# EAGLE design Impedance R6 Updated (EAGLE 9.6.2)
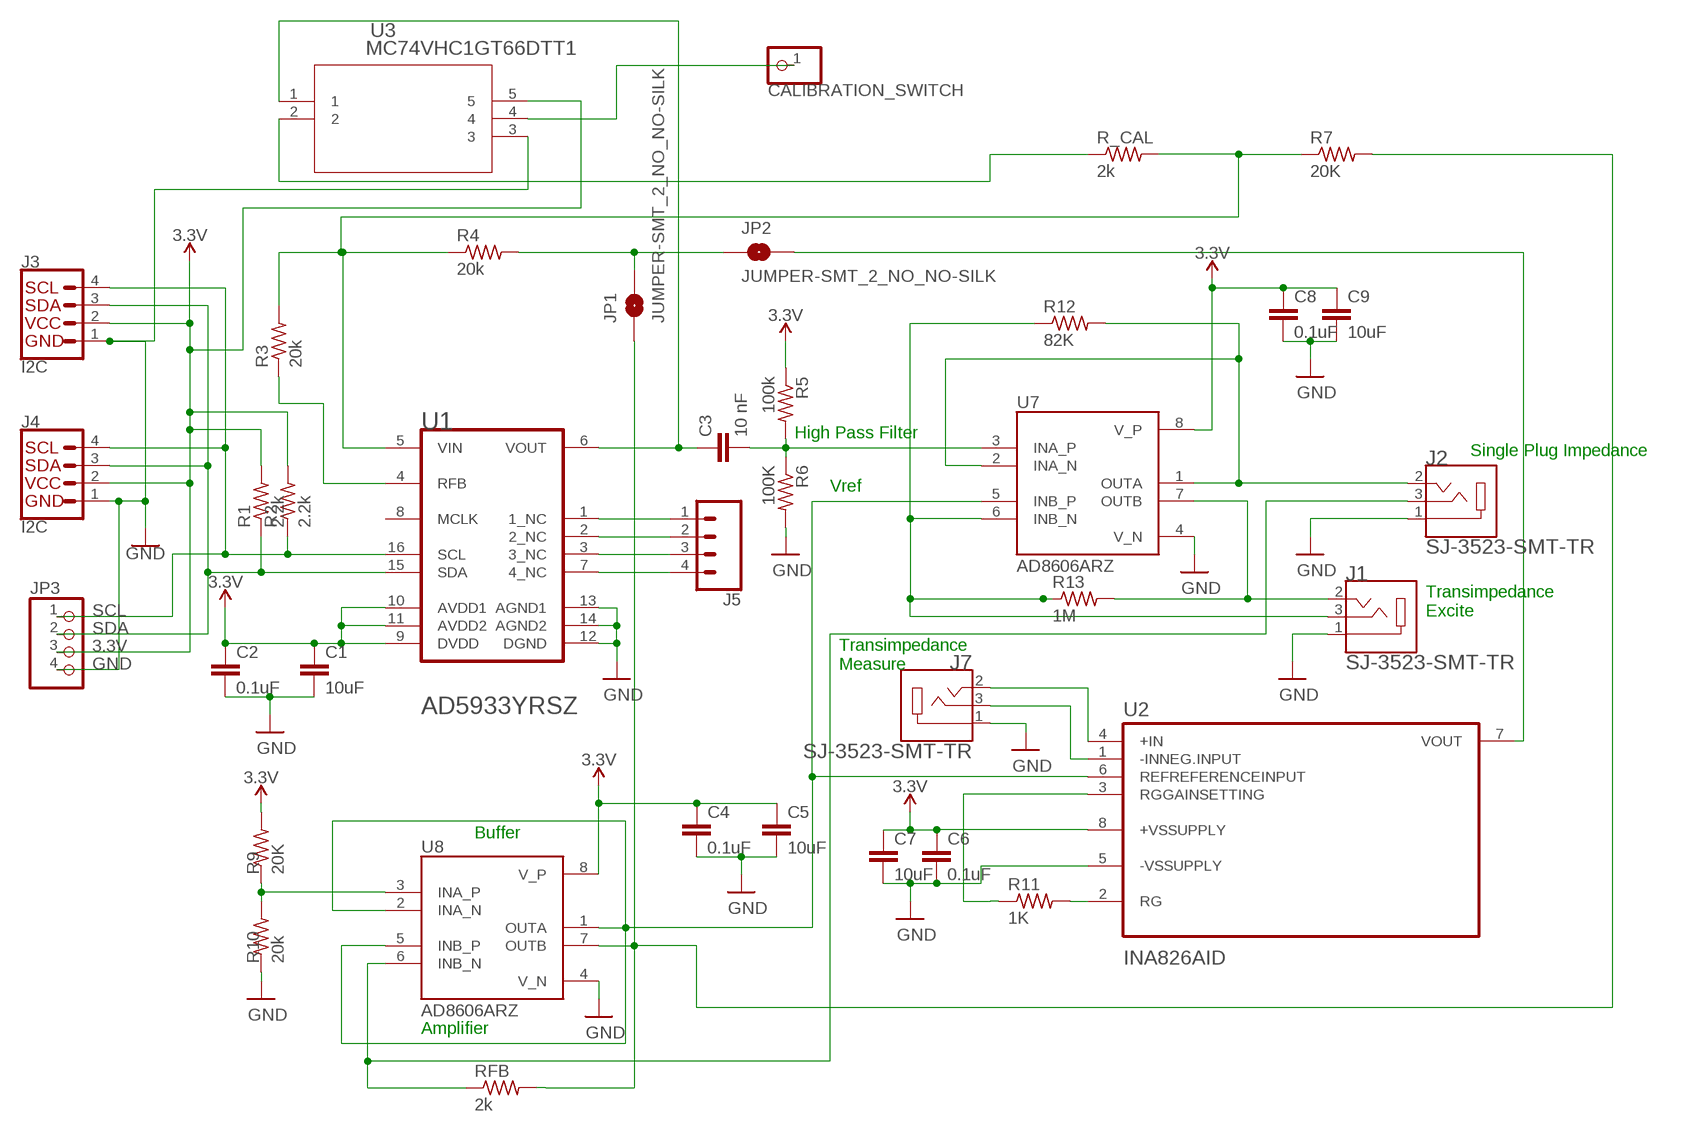
[diagram p0: schematic, sheet 1]

## Parts
C1  10uF  C-EUC0603  [C0603]
C2  0.1uF  C-EUC0603  [C0603]
C3  10 nF  C-EUC0603  [C0603]
C4  0.1uF  C-EUC0603  [C0603]
C5  10uF  C-EUC0603  [C0603]
C6  0.1uF  C-EUC0603  [C0603]
C7  10uF  C-EUC0603  [C0603]
C8  0.1uF  C-EUC0603  [C0603]
C9  10uF  C-EUC0603  [C0603]
CALIBRATION_SWITCH  PINHD-1X1  [1X01]
J1  SJ-3523-SMT-TR  [CUI_SJ-3523-SMT-TR]
J2  SJ-3523-SMT-TR  [CUI_SJ-3523-SMT-TR]
J3  I2C  QWIIC_CONNECTORJS-1MM  [JST04_1MM_RA]
J4  I2C  QWIIC_CONNECTORJS-1MM  [JST04_1MM_RA]
J5  CONN_04  [1X04]
J7  SJ-3523-SMT-TR  [CUI_SJ-3523-SMT-TR]
JP1  JUMPER-SMT_2_NO_NO-SILK  [SMT-JUMPER_2_NO_NO-SILK]
JP2  JUMPER-SMT_2_NO_NO-SILK  [SMT-JUMPER_2_NO_NO-SILK]
JP3  PINHD-1X4  [1X04]
R1  2.2k  R-US_R0603  [R0603]
R2  2.2k  R-US_R0603  [R0603]
R3  20k  R-US_R0603  [R0603]
R4  20k  R-US_R0603  [R0603]
R5  100k  R-US_R0603  [R0603]
R6  100K  R-US_R0603  [R0603]
R7  20K  R-US_R0603  [R0603]
R9  20K  R-US_R0603  [R0603]
R10  20k  R-US_R0603  [R0603]
R11  1K  R-US_R0603  [R0603]
R12  82K  R-US_R0603  [R0603]
R13  1M  R-US_R0603  [R0603]
R_CAL  2k  R-US_R0603  [R0603]
RFB  2k  R-US_R0603  [R0603]
U1  ANALOG_DEVICES_AD5933YRSZANALOG_DEVICES_AD5933YRSZ_0_0  [ANALOG_DEVICES_AD5933YRSZ_0]
U2  INA826AID  [SOIC127P599X175-8N]
U3  MC74VHC1GT66DTT1  [TSOP5_1P65X3P15_ONS]
U7  AD8606ARZ  [SOIC127P600X175-8N]
U8  AD8606ARZ  [SOIC127P600X175-8N]

## Nets
3.3V: C1.1 C2.1 C4.1 C5.1 C6.1 C7.1 C8.1 C9.1 J3.2 J4.2 JP3.3 R1.2 R2.2 R5.1 R9.2 U1.9(DVDD) U1.10(AVDD1) U1.11(AVDD2) U2.8(+VSSUPPLY) U3.5 U7.8(V_P) U8.8(V_P)
GND: C1.2 C2.2 C4.2 C5.2 C6.2 C7.2 C8.2 C9.2 J1.1 J2.1 J3.1 J4.1 J7.1 JP3.4 R6.2 R10.1 U1.12(DGND) U1.13(AGND1) U1.14(AGND2) U2.5(-VSSUPPLY) U3.3 U7.4(V_N) U8.4(V_N)
N$1: C3.1 U1.6(VOUT) U3.1
N$2: R_CAL.1 U3.2
N$3: J5.1 U1.1(1_NC)
N$4: J5.2 U1.2(2_NC)
N$5: R3.1 U1.4(RFB)
N$6: R3.2 R4.1 R7.1 R_CAL.2 U1.5(VIN)
N$7: JP1.2 JP2.1 R4.2
N$9: C3.2 R5.2 R6.1 U7.3(INA_P)
N$10: J5.3 U1.3(3_NC)
N$11: J5.4 U1.7(4_NC)
N$12: JP1.1 R7.2 RFB.2 U8.7(OUTB)
N$13: U2.6(REFREFERENCEINPUT) U7.5(INB_P) U8.1(OUTA) U8.2(INA_N) U8.5(INB_P)
N$14: R9.1 R10.2 U8.3(INA_P)
N$15: J2.2 R12.2 U7.1(OUTA) U7.2(INA_N)
N$16: R11.1 U2.3(RGGAINSETTING)
N$17: J2.3 RFB.1 U8.6(INB_N)
N$18: R11.2 U2.2(RG)
N$19: J1.2 R13.2 U7.7(OUTB)
N$20: J7.2 U2.4(+IN)
N$21: J7.3 U2.1(-INNEG.INPUT)
N$23: J1.3 R12.1 R13.1 U7.6(INB_N)
N$24: CALIBRATION_SWITCH.1 U3.4
N$25: JP2.2 U2.7(VOUT)
SCL: J3.4 J4.4 JP3.1 R2.1 U1.16(SCL)
SDA: J3.3 J4.3 JP3.2 R1.1 U1.15(SDA)
Unconnected: U1.8(MCLK)

## Notes on the sheet
- High Pass Filter
- Single Plug Impedance
- Vref
- Transimpedance
  Excite
- Transimpedance
  Measure
- Buffer
- Amplifier

## Library data of the parts
C1-C9 = rcl:C-EU: CAPACITOR, European symbol; SPICEPREFIX: C
CALIBRATION_SWITCH = pinhead:PINHD-1X1: PIN HEADER
J1 J2 J7 = SJ-3523-SMT-TR:SJ-3523-SMT-TR: Audio Jack Connector 3.5 mm Low Profile Surface Mount Stereo Jack, 3 Pin Right-Angle Check availability <https://pricing.snapeda.com/parts/SJ-3523-SMT-TR/CUI%20Devices/view-part?ref=eda>; AVAILABILITY: In Stock; CUI_PURCHASE_URL: https://www.cuidevices.com/product/interconnect/connectors/audio-connectors/jacks/sj-352x-smt-series?utm_source=snapeda.com&utm_medium=referral&utm_campaign=snapedaBOM; DESCRIPTION: 3.5 mm, Stereo, Right Angle, Surface Mount (SMT), 3 Conductors, 0~1 Internal Switches, Audio Jack Connector; MF: CUI Devices; MP: SJ-3523-SMT-TR; PACKAGE: None; PRICE: None; PURCHASE-URL: https://pricing.snapeda.com/search/part/SJ-3523-SMT-TR/?ref=eda
J3 J4 = SparkFun-Connectors:QWIIC_CONNECTOR: SparkFun I2C Standard Qwiic Connector An SMD 1mm pitch JST connector makes it easy and quick (get it? Qwiic?) to connect I2C devices to each other. The Qwiic system <http://www.sparkfun.com/qwiic> enables fast and solderless connection between popular platforms and various sensors and actuators. We carry 200mm <https://www.sparkfun.com/products/14204>, 100mm <https://www.sparkfun.com/products/14205>, 50mm <https://www.sparkfun.com/products/14206>, and breadboard friendly <https://www.sparkfun.com/products/14207> Qwiic cables. We also offer 10 pcs strips <https://www.sparkfun.com/products/14323> the SMD connectors.; PROD_ID: CONN-13694
J5 = SparkFun-Connectors:CONN_04: Multi connection point. Often used as Generic Header-pin footprint for 0.1 inch spaced/style header connections On any of the 0.1 inch spaced packages, you can populate with these: Break Away Headers - Straight <https://www.sparkfun.com/products/116> (PRT-00116) Break Away Male Headers - Right Angle <https://www.sparkfun.com/products/553> (PRT-00553) Female Headers <https://www.sparkfun.com/products/115> (PRT-00115) Break Away Headers - Machine Pin <https://www.sparkfun.com/products/117> (PRT-00117) Break Away Female Headers - Swiss Machine Pin <https://www.sparkfun.com/products/743> (PRT-00743) For SCREWTERMINALS and SPRING TERMINALS visit here: Screw Terimnals on SparkFun.com <https://www.sparkfun.com/search/results?term=Screw+Terminals> (5mm/3.5mm/2.54mm spacing) This device is also useful as a general connection point to wire up your design to another part of your project. Our various solder wires solder well into these plated through hole pads. Hook-Up Wire - Assortment (Stranded, 22 AWG) <https://www.sparkfun.com/products/11375> (PRT-11375) Hook-Up Wire - Assortment (Solid Core, 22 AWG) <https://www.sparkfun.com/products/11367> (PRT-11367) View the entire wire category on our website here <https://www.sparkfun.com/categories/141> Special notes: Molex polarized connector foot print use with SKU : PRT-08231 with associated crimp pins and housings. 1MM SMD Version SKU: PRT-10208; PROD_ID: CONN-09696
JP1 JP2 = SparkFun-Jumpers:JUMPER-SMT_2_NO: Normally open jumper This jumper has two pads in close proximity to each other. Apply solder to close the connection. Round pads are easier to solder for beginners, but are a lot larger. SparkFun Product that uses the round pads: SparkFun EL Sequencer <https://www.sparkfun.com/products/12781>
JP3 = pinhead:PINHD-1X4: PIN HEADER
R1-R7 R9-R13 R_CAL RFB = rcl:R-US_: RESISTOR, American symbol; SPICEPREFIX: R
U1 = Analog Devices - AD5933YRSZ:ANALOG_DEVICES_AD5933YRSZ: ADI-AD5933-RS-16; CIIVA_IDS: 19299999; CODE__JEDEC: MO-150-AC; COMPONENT_LINK_1_DESCRIPTION: Manufacturer URL; COMPONENT_LINK_1_URL: www.analog.com; COMPONENT_LINK_3_DESCRIPTION: Package Specification; COMPONENT_LINK_3_URL: http://www.analog.com/static/imported-files/packages/31572257652246RS_16.pdf; DATASHEET: http://www.analog.com/static/imported-files/data_sheets/AD5933.pdf; DATASHEET_VERSION: Rev. D; FOOTPRINT_VARIANT_NAME_0: Level C; FOOTPRINT_VARIANT_NAME_1: Level B; FOOTPRINT_VARIANT_NAME_2: Level A; IMPORTED: yes; IMPORTED_FROM: vault; IMPORT_TS: 1521848033; IO_INTERFACE: Serial; I_SUPPLY_TOTAL_MAX: 15mA; MASTER_FCLK: 16.776MHz; MF: Analog Devices; MPN: AD5933YRSZ; PACKAGE: RS-16; PACKAGE_DESCRIPTION: 16-Lead Shrink Small Outline Package [SSOP]; PACKAGE_VERSION: 3/17/2005; PIN_0_0_15_INSIDE_EDGE: clock; PIN_0_0_7_INSIDE_EDGE: clock; PREFIX: U; RELEASE_DATE: 1333437714; RESOLUTION_BITS: 12bit; TUNING_WORD_WIDTH_BITS: 27bit; VAULT_GUID: 12E548FF-7E75-4596-9B3A-06B167E4919E; VAULT_REVISION: 0B288880-7FBC-46A2-8187-17CED40A7223
U2 = INA826AID:INA826AID: Check availability <https://pricing.snapeda.com/parts/INA826AID/Texas%20Instruments/view-part?ref=eda>; AVAILABILITY: In Stock; CHECK_PRICES: https://www.snapeda.com/parts/INA826AID/Texas+Instruments/view-part/?ref=eda; DESCRIPTION: Precision, 200-μA Supply Current, 36-V Supply Instrumentation Amplifier; MF: Texas Instruments; MP: INA826AID; PACKAGE: SOIC-8 Texas Instruments; PRICE: None; PURCHASE-URL: https://www.snapeda.com/api/url_track_click_mouser/?unipart_id=217743&manufacturer=Texas Instruments&part_name=INA826AID&search_term=None; SNAPEDA_LINK: https://www.snapeda.com/parts/INA826AID/Texas+Instruments/view-part/?ref=snap
U3 = MC74VHC1GT66DTT1:MC74VHC1GT66DTT1; COPYRIGHT: Copyright (C) 2024 Ultra Librarian. All rights reserved.; MANUFACTURER_PART_NUMBER: MC74VHC1GT66DTT1; MFR_NAME: onsemi
U7 U8 = AD8606ARZ:AD8606ARZ: Operational amplifier; 10MHz; 2.7÷5VDC; Channels: 2; SO8 Check availability <https://pricing.snapeda.com/parts/AD8606ARZ/Analog%20Devices/view-part?ref=eda>; AVAILABILITY: In Stock; CHECK_PRICES: https://www.snapeda.com/parts/AD8606ARZ/Analog+Devices/view-part/?ref=eda; DESCRIPTION: Precision, Low Noise, RRIO, CMOS Op Amp (Dual); MF: Analog Devices; MP: AD8606ARZ; PACKAGE: SOIC-8 Analog Devices; PRICE: None; PURCHASE-URL: https://www.snapeda.com/api/url_track_click_mouser/?unipart_id=43414&manufacturer=Analog Devices&part_name=AD8606ARZ&search_term=None; SNAPEDA_LINK: https://www.snapeda.com/parts/AD8606ARZ/Analog+Devices/view-part/?ref=snap

## Board
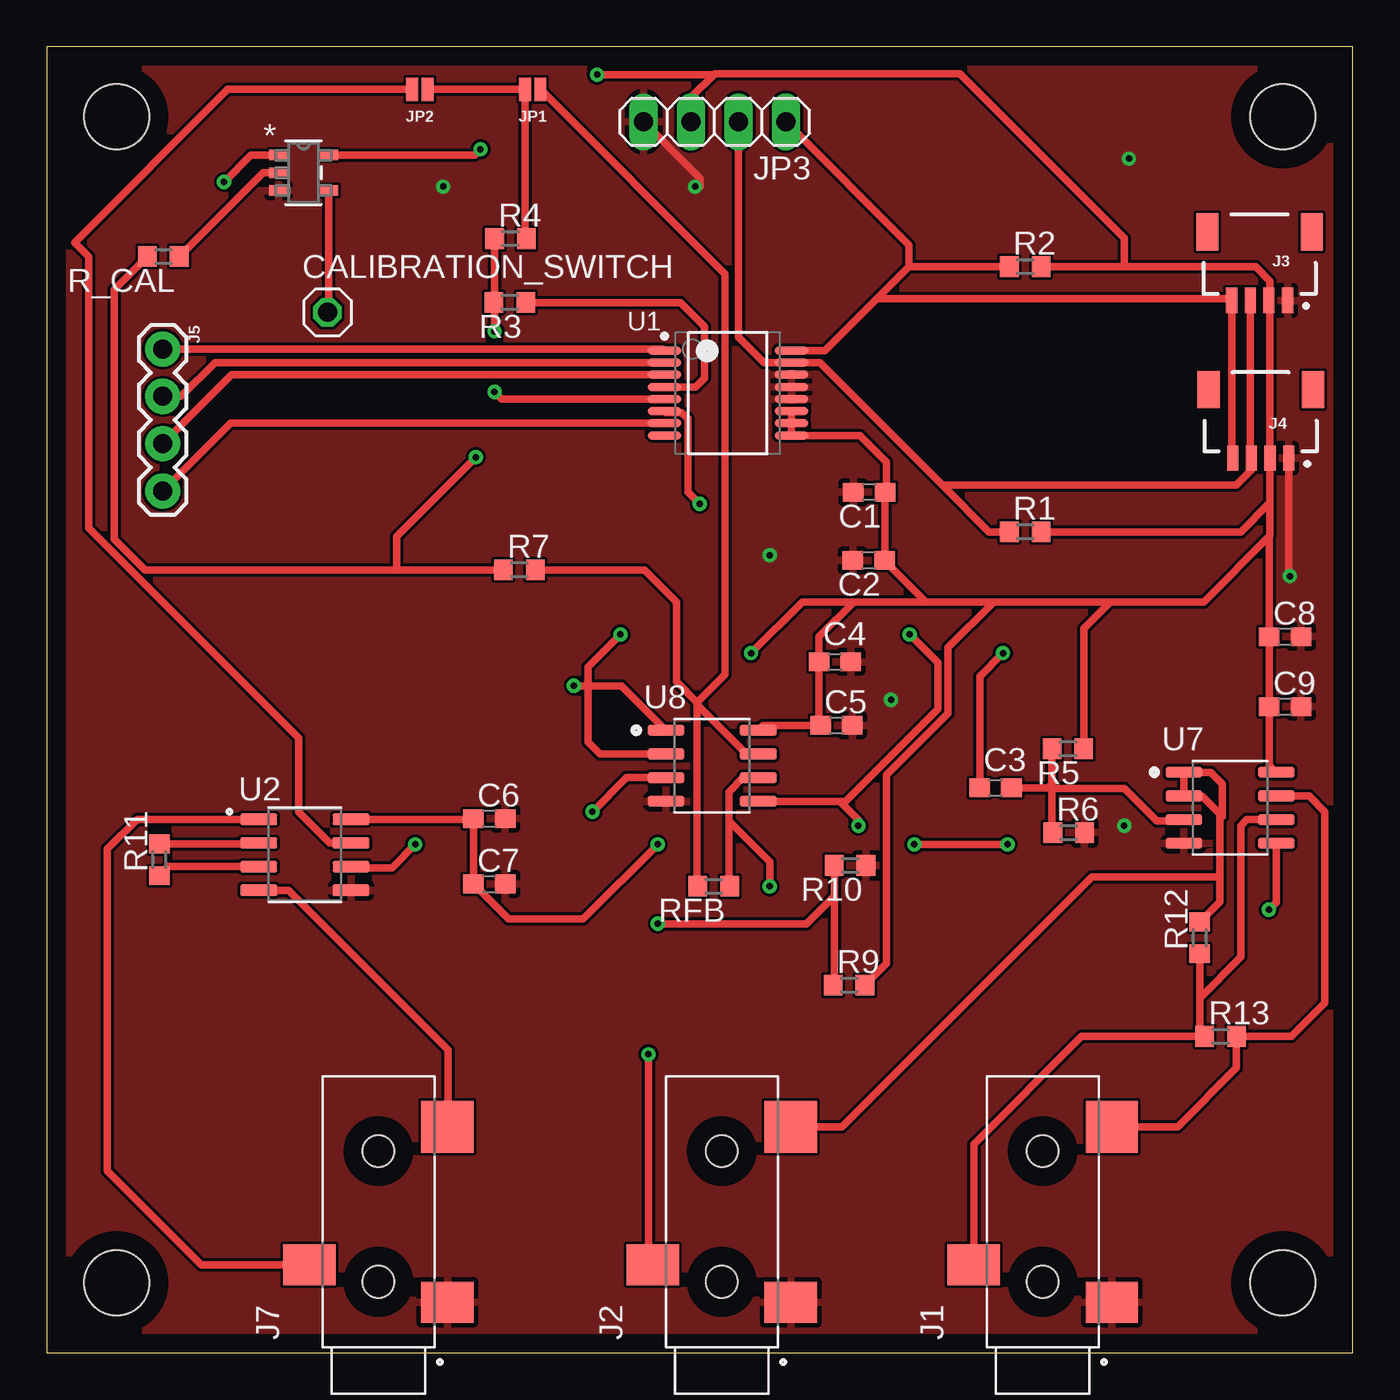
[diagram p1: board, top side]
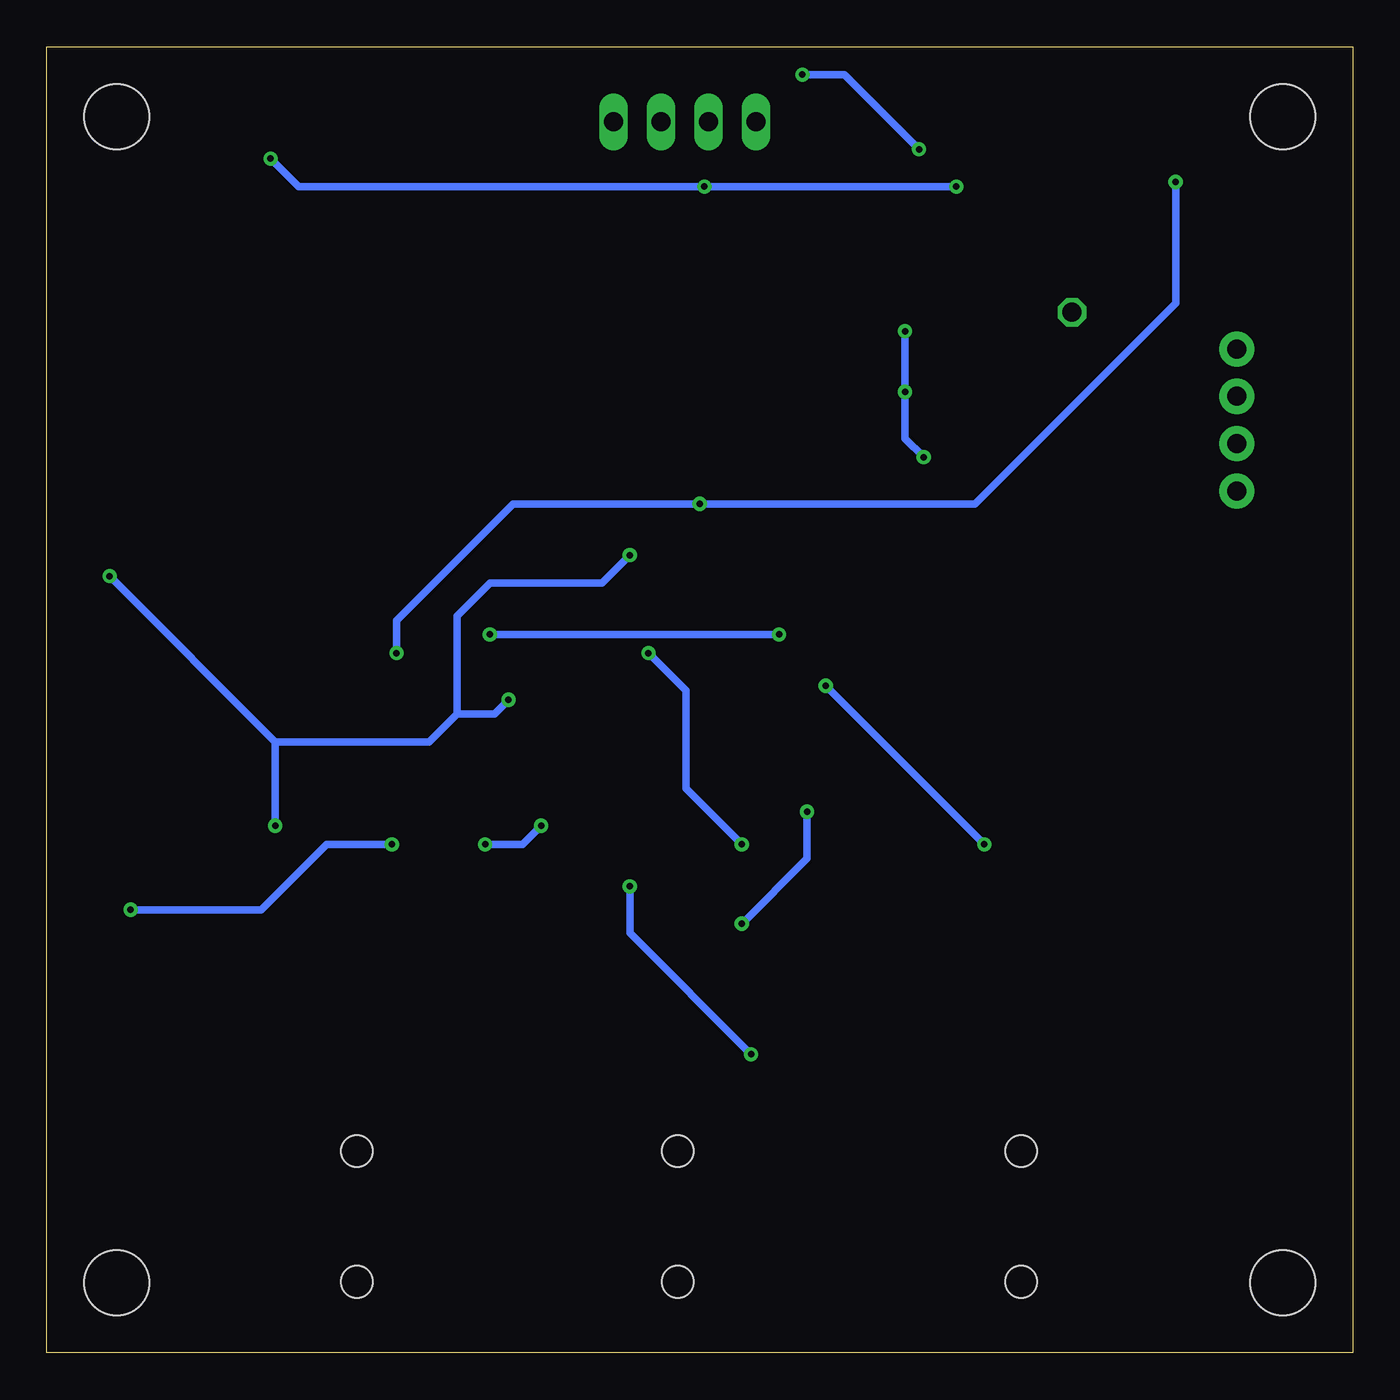
[diagram p2: board, bottom side, seen from below]

Size 70 x 70 mm. Coordinates in mm from the lower left corner, seen from the top.
Outline: 0,0 70,0 70,70 0,70 0,0
Copper layers (1*16): Top 0.035mm / dielectric 1.5mm / Bottom 0.035mm
Design rules "default": minimum track width 6mil, minimum drill 0.35mm, track to track 6mil, track to pad 6mil, pad to pad 6mil, via to via 6mil, smd to smd 6mil, copper to edge 40mil, drill to drill 6mil, minimum pad ring 10mil, minimum via ring 8mil, stop-mask expansion 4mil, vias tented up to drill 0mil, thermal gap 10mil
Holes 3.5 mm at 3.75,3.75 66.25,3.75 66.25,66.25 3.75,66.25

### Footprints (pad centres in the part's own frame; a part is rotated, then mirrored left to right if it is on the bottom)
C0603 = smd 1.1 x 1: 1 -0.85,0; 2 0.85,0
1X01 = drill 1.016 octagon: 1 0,0
CUI_SJ-3523-SMT-TR = smd 2.2 x 2.8: 1 -1.1,-3.7; 3 0.9,3.7 | smd 2.8 x 2.8: 2 8.3,-3.7 | hole 1.7: 0,0; 7,0
JST04_1MM_RA = smd 0.6 x 1.35: 1 -1.5,0; 2 -0.5,0; 3 0.5,0; 4 1.5,0 | smd 1.2 x 2: NC1 2.8,-3.675; NC2 -2.8,-3.675
1X04 = drill 1.016 pad 1.88: 1 0,0; 2 2.54,0; 3 5.08,0; 4 7.62,0
SMT-JUMPER_2_NO_NO-SILK = smd 0.635 x 1.27: 1 -0.406,0; 2 0.406,0
1X04' = drill 1.016 long: 1 -3.81,0; 2 -1.27,0; 3 1.27,0; 4 3.81,0
R0603 = smd 1 x 1.1: 1 -0.85,0; 2 0.85,0
ANALOG_DEVICES_AD5933YRSZ_0 = smd 1.8 x 0.45: 1 -3.4,2.275; 2 -3.4,1.625; 3 -3.4,0.975; 4 -3.4,0.325; 5 -3.4,-0.325; 6 -3.4,-0.975; 7 -3.4,-1.625; 8 -3.4,-2.275; 9 3.4,-2.275; 10 3.4,-1.625; 11 3.4,-0.975; 12 3.4,-0.325; 13 3.4,0.325; 14 3.4,0.975; 15 3.4,1.625; 16 3.4,2.275
SOIC127P599X175-8N = smd 1.97 x 0.6: 1 -2.47,1.905; 2 -2.47,0.635; 3 -2.47,-0.635; 4 -2.47,-1.905; 5 2.47,-1.905; 6 2.47,-0.635; 7 2.47,0.635; 8 2.47,1.905
TSOP5_1P65X3P15_ONS = smd 1.029 x 0.559: 1 -1.34,0.95; 2 -1.34,0; 3 -1.34,-0.95; 4 1.34,-0.95; 5 1.34,0.95
SOIC127P600X175-8N = smd 1.97 x 0.6: 1 -2.475,1.905; 2 -2.475,0.635; 3 -2.475,-0.635; 4 -2.475,-1.905; 5 2.475,-1.905; 6 2.475,-0.635; 7 2.475,0.635; 8 2.475,1.905

### Placement (x,y rotation side)
C1  44.08,46.12 180 top
C2  44.05,42.47 180 top
C3  50.85,30.28 0 top
C4  42.25,37.03 0 top
C5  42.32,33.63 0 top
C6  23.72,28.63 0 top
C7  23.72,25.13 0 top
C8  66.37,38.38 0 top
C9  66.37,34.63 0 top
CALIBRATION_SWITCH  15.05,55.76 0 top
J1  53.38,3.81 90 top
J2  36.18,3.81 90 top
J3  65,56.4 180 top
J4  65.06,47.95 180 top
J5  6.22,53.8 270 top
J7  17.78,3.81 90 top
JP1  26.05,67.71 180 top
JP2  20,67.71 180 top
JP3  [1X04']  35.8,65.97 180 top
R1  52.44,44 0 top
R2  52.44,58.21 0 top
R3  24.82,56.29 180 top
R4  24.85,59.71 0 top
R5  54.73,32.37 180 top
R6  54.77,27.88 0 top
R7  25.33,41.96 0 top
R9  43,19.71 0 top
R10  43.06,26.12 180 top
R11  6.04,26.42 90 top
R12  61.79,22.24 90 top
R13  62.91,16.96 0 top
R_CAL  6.25,58.75 180 top
RFB  35.75,25 180 top
U1  36.51,51.44 0 top
U2  13.84,26.69 0 top
U3  13.77,63.24 0 top
U7  63.42,29.21 0 top
U8  35.66,31.46 0 top

### Tracks (layer width: path | path; a pad name or v marks a point on that pad's centre or on a via)
3.3V  (via drill 0.35)
  Top 0.406: J3.2 65.56,56.34 | 65.56,56.34 J4.2 65.56,45.56 | R2.2 57.75,58.21 | 57.75,58.21 64.79,58.21 65.56,57.44 65.56,56.34 | R1.2 64,44 65.56,45.56 | JP3.3 34.53,67.28 35.75,68.5 | 57.75,58.21 57.75,59.75 48.94,68.56 35.81,68.56 35.75,68.5 | U1.11 U1.10 U1.9 43.59,49.16 45,47.75 45,46.19 C1.1 44.93,42.5 C2.1 47.12,40.25 | 47.12,40.25 50.75,40.25 | 50.75,40.25 57,40.25 | 57,40.25 62,40.25 65.52,43.77 | 65.56,45.56 65.56,43.81 65.52,43.77 | 43.25,40.25 41.4,38.4 C4.1 41.4,33.7 C5.1 38.4,33.63 U8.8 | 43.25,40.25 47.12,40.25 | U3.5 22.94,64.19 v23.25,64.5 | v29.5,68.5 35.75,68.5 | U2.8 22.84,28.59 C6.1 C7.1 24.75,23.25 28.75,23.25 v32.75,27.25 | v37.75,37.5 40.5,40.25 43.25,40.25 | R9.2 45,20.86 45,30.96 48.31,34.27 48.31,37.81 50.75,40.25 | R5.1 55.58,38.83 57,40.25 | U7.8 65.52,31.49 C9.1 C8.1 65.52,43.77
  Bottom 0.406: v23.25,64.5 27.25,68.5 v29.5,68.5 | v32.75,27.25 35.75,30.25 35.75,35.5 v37.75,37.5
GND  (via drill 0.35)
  Top 0.406: JP3.4 35,62.96 35,62.5 v34.75,62.5 | J4.1 66.56,41.81 66.5,41.75 v66.62,41.62
  Bottom 0.406: v58,64 56.5,62.5 v34.75,62.5 v21.25,62.5 | v66.62,41.62 57.75,32.75 | 57.75,32.75 v57.75,28.25 | 57.75,32.75 49.5,32.75 48,34.25 | 48,34.25 48,39.5 46.25,41.25 40.25,41.25 v38.75,42.75 | 48,34.25 46,34.25 v45.25,35
  pour Top: 0,70 70,70 70.25,69.75 70.25,0 0,0
N$1  (via drill 0.35)
  Top 0.406: C3.1 50,36.25 v51.25,37.5 | U1.6 33.18,50.4 34.02,50.4 34.37,50.05 34.37,46.13 v35,45.5 | U3.1 10.94,64.19 v9.5,62.75
  Bottom 0.406: v51.25,37.5 51.25,39.25 45,45.5 v35,45.5 20.25,45.5 9.5,56.25 v9.5,62.75
N$2
  Top 0.406: R_CAL.1 11.59,63.24 U3.2
N$3
  Top 0.406: J5.1 33.02,53.8 U1.1
N$4
  Top 0.406: J5.2 7.22,51.26 9.02,53.06 U1.2
N$5
  Top 0.406: U1.4 34.77,51.77 35.25,52.25 35.25,55 33.96,56.29 R3.1
N$6  (via drill 0.35)
  Top 0.406: U1.5 24.39,51.12 v24,51.5 | v24,54.75 24,56.26 | 24,56.26 R3.2 | R4.1 24,56.26 | R7.1 18.75,41.96 | 18.75,41.96 5.29,41.96 3.62,43.62 3.62,56.98 R_CAL.2 | v23,48 18.75,43.75 18.75,41.96
  Bottom 0.406: v24,54.75 v24,51.5 24,49 v23,48
N$7
  Top 0.406: R4.2 25.64,59.77 JP1.2 JP2.1
N$9
  Top 0.406: R5.2 53.88,30.5 | 53.88,30.5 53.88,30.25 | 53.88,30.25 53.88,27.92 R6.1 | C3.2 53.66,30.28 53.88,30.5 | 53.88,30.25 57.75,30.25 59.5,28.5 60.87,28.5 U7.3
N$10
  Top 0.406: J5.3 9.91,52.41 U1.3
N$11
  Top 0.406: J5.4 9.86,49.81 U1.7
N$12
  Top 0.406: JP1.1 36.36,57.81 36.36,36.36 34.86,34.86 | 34.86,34.86 34.86,34.75 | 34.86,34.86 33.75,35.97 33.75,40.25 32.04,41.96 R7.2 | U8.7 37.52,32.09 34.86,34.75 | RFB.2 34.86,25.04 34.86,34.75
N$13  (via drill 0.35)
  Top 0.406: U8.5 42.5,29.55 | 42.5,29.55 42.8,29.55 47.75,34.5 47.75,37 v46.25,38.5 | v30.75,38.5 29,36.75 29,35.75 | 29,35.75 29,32.75 29.66,32.09 U8.2 | U8.1 30.8,35.75 29,35.75 | 29,35.75 v28.25,35.75 | U2.6 16.36,26 18.5,26 v19.75,27.25 | 42.5,29.55 43.5,28.55 v43.5,28.25 | v46.5,27.25 v51.5,27.25 | v65.5,23.75 65.89,24.14 U7.5
  Bottom 0.406: v46.25,38.5 v30.75,38.5 | v19.75,27.25 v28.25,35.75 | v43.5,28.25 44.5,27.25 v46.5,27.25 | v51.5,27.25 55,27.25 58.5,23.75 v65.5,23.75
N$14  (via drill 0.35)
  Top 0.406: R10.2 42.21,24.5 | 42.21,24.5 42.21,19.77 R9.1 | U8.3 31.07,30.82 v29.25,29 | v32.75,23 40.71,23 42.21,24.5
  Bottom 0.406: v29.25,29 29.25,26.5 v32.75,23
N$15
  Top 0.406: 62.88,28.88 61.91,29.84 U7.2 U7.1 62.38,31.11 63,30.5 63,28.75 62.88,28.88 | 62.88,28.88 62.88,25.5 | 62.88,25.5 62.88,24.18 R12.2 | 62.88,25.5 56,25.5 42.61,12.11 J2.2
N$16
  Top 0.406: R11.1 6.53,26.05 U2.3
N$17  (via drill 0.35)
  Top 0.406: 36.56,28.5 36.56,30.06 37.33,30.82 U8.6 | 36.56,28.5 38.75,26.31 v38.75,25 | v32.25,16 32.25,4.94 J2.3 | RFB.1 36.56,25.04 36.56,28.5
  Bottom 0.406: v38.75,25 38.75,22.5 v32.25,16
N$18
  Top 0.406: R11.2 11.31,27.27 U2.2
N$19
  Top 0.406: U7.7 67.66,29.84 68.5,29 68.5,18.75 66.71,16.96 R13.2 63.76,15.26 60.61,12.11 J1.2
N$20
  Top 0.406: U2.4 12.96,24.79 21.5,16.25 21.5,12.13 J7.2
N$21
  Top 0.406: U2.1 4.84,28.59 3.25,27 3.25,9.75 8.29,4.71 J7.3
N$23
  Top 0.406: R12.1 61.79,19 | 61.79,19 61.79,17.23 R13.1 55.46,16.96 49.68,11.18 J1.3 | 61.79,19 64,21.21 64,28.25 64.33,28.57 U7.6
N$24
  Top 0.406: U3.4 15.11,55.82 CALIBRATION_SWITCH.1
N$25
  Top 0.406: JP2.2 9.71,67.71 1.5,59.5 2.27,58.73 2.27,44.2 13.5,32.96 13.5,29 15.18,27.32 U2.7
SCL
  Top 0.406: J4.4 63.5,48.01 J3.4 63.4,56.5 44.5,56.5 | U1.16 41.72,53.72 44.5,56.5 | 44.5,56.5 46.21,58.21 | 46.21,58.21 R2.1 | JP3.1 46.21,59.37 46.21,58.21
SDA
  Top 0.406: J3.3 64.5,48.01 J4.3 64.56,47.31 63.75,46.5 48,46.5 | 48,46.5 41.44,53.06 U1.15 38.44,53.06 37.07,54.43 JP3.2 | 48,46.5 50.5,44 R1.1